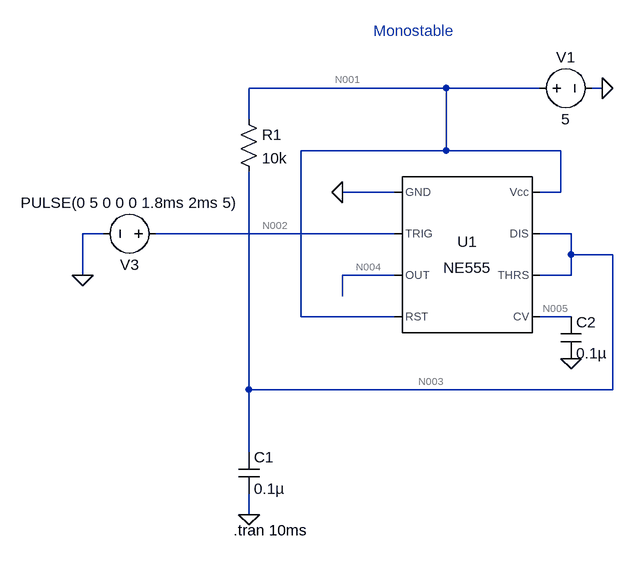
[diagram p0: schematic 555Timersimulation.asc]
555Timersimulation.asc, the LTspice schematic file:
Version 4
SHEET 1 880 1688
WIRE 192 -48 -112 -48
WIRE 336 -48 192 -48
WIRE 432 -48 416 -48
WIRE -112 0 -112 -48
WIRE 192 48 192 -48
WIRE 192 48 -32 48
WIRE 368 48 192 48
WIRE 112 112 32 112
WIRE 368 112 368 48
WIRE 368 112 336 112
WIRE -336 176 -368 176
WIRE 112 176 -256 176
WIRE 384 176 336 176
WIRE 384 208 384 176
WIRE 448 208 384 208
WIRE -368 240 -368 176
WIRE 112 240 32 240
WIRE 384 240 384 208
WIRE 384 240 336 240
WIRE 32 272 32 240
WIRE -32 304 -32 48
WIRE 112 304 -32 304
WIRE 384 304 336 304
WIRE -112 416 -112 80
WIRE 448 416 448 208
WIRE 448 416 -112 416
WIRE -112 512 -112 416
WIRE -112 608 -112 576
FLAG 32 112 0
FLAG 432 -48 0
FLAG -112 608 0
FLAG 384 368 0
FLAG -368 240 0
SYMBOL Misc\\NE555 224 208 R0
SYMATTR InstName U1
SYMBOL voltage 320 -48 R270
WINDOW 0 32 56 VTop 2
WINDOW 3 -32 56 VBottom 2
WINDOW 123 0 0 Left 0
WINDOW 39 0 0 Left 0
SYMATTR InstName V1
SYMATTR Value 5
SYMBOL res -128 -16 R0
SYMATTR InstName R1
SYMATTR Value 10k
SYMBOL cap -128 512 R0
SYMATTR InstName C1
SYMATTR Value 0.1µ
SYMBOL cap 368 304 R0
SYMATTR InstName C2
SYMATTR Value 0.1µ
SYMBOL voltage -240 176 R90
WINDOW 0 32 56 VTop 2
WINDOW 3 -32 56 VBottom 2
WINDOW 123 0 0 Left 0
WINDOW 39 0 0 Left 0
SYMATTR InstName V3
SYMATTR Value PULSE(0 5 0 0 0 1.8ms 2ms 5)
TEXT -136 632 Left 2 !.tran 10ms
TEXT 80 -136 Left 2 ;Monostable

The netlist it stands for:
* 555Timersimulation.asc
XU1 0 N002 N004 N001 N005 N003 N003 N001 NE555  ; pins GND TRIG OUT RST CV THRS DIS Vcc
V1 N001 0 5
R1 N001 N003 10k
C1 N003 0 0.1µ
C2 N005 0 0.1µ
V3 N002 0 PULSE(0 5 0 0 0 1.8ms 2ms 5)
.tran 10ms
* Monostable
.lib NE555.sub
.backanno
.end

* Results of the author's LTspice run, read from the files saved beside the schematic
* Operating Point, zero values left out:
*   V(n005) = 3.333 V
*   V(n001) = 5 V
*   V(n003) = 5 V
*   V(n004) = 5 V
*   I(R1) = 11.67 nA
*   I(V1) = -1.611 mA
*   Ix(u1:1) = -1.611 mA
*   Ix(u1:4) = 22.67 µA
*   Ix(u1:6) = 5 nA
*   Ix(u1:7) = 6.672 nA
*   Ix(u1:8) = 1.588 mA
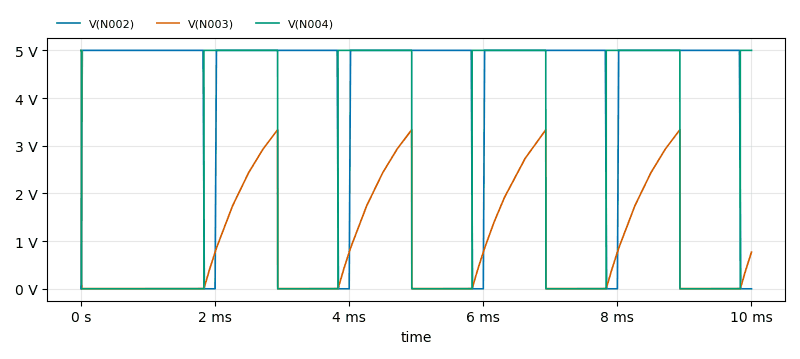
[diagram p1: Transient Analysis of 555Timersimulation.asc, plotted from the saved traces]
* Transient Analysis, 1 run:
*   V(N002): min 0 V, max 5 V, average 4.55 V, rms 4.766 V, last 0 V
*   V(N003): min 2.998 mV, max 5 V, average 872.9 mV, rms 1.46 V, last 769.9 mV
*   V(N004): min 30 µV, max 5 V, average 2.284 V, rms 3.379 V, last 5 V